# EasyEDA Pro project pcb.epro

# Schematic Schematic1
Board Name: Board1; Create Date: 2025-04-16; Page Name: P1; Project Name: slamcari; Schematic Name: Schematic1; Update Date: 2025-04-28; Company: 嘉立创EDA; Page Size: A4; Version: V1.0
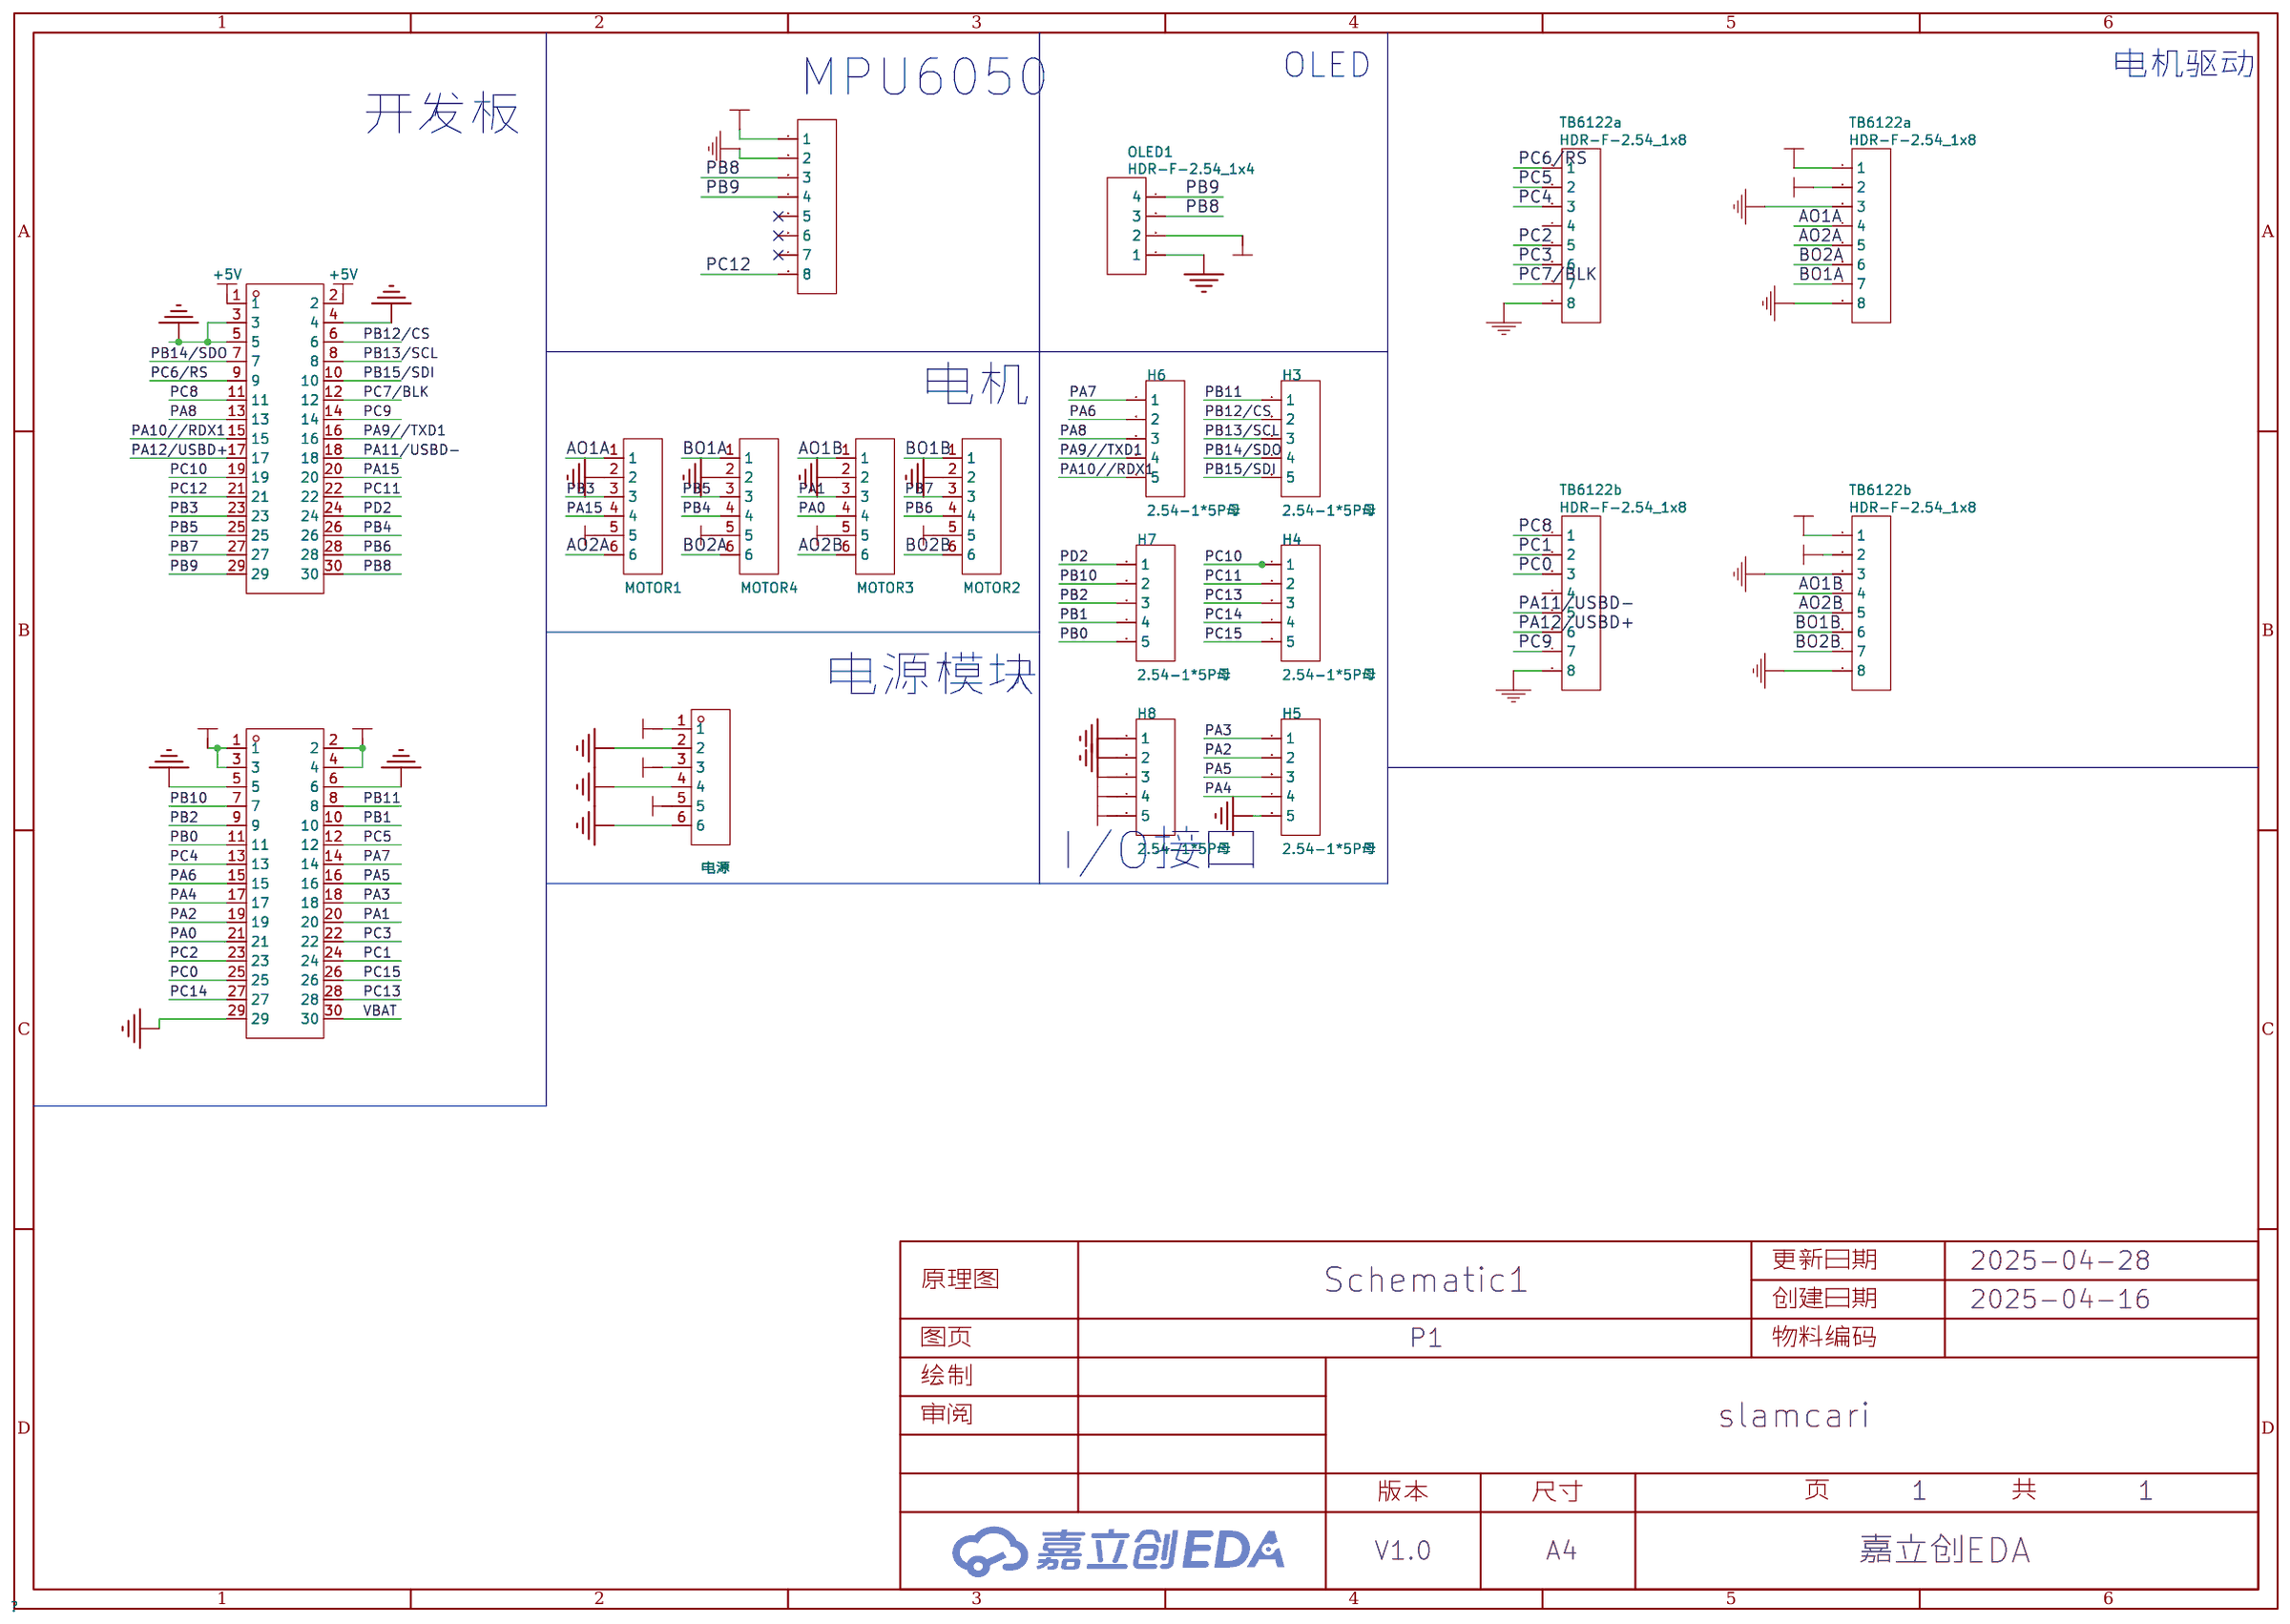
[diagram p0: schematic sheet]

## Parts
H3  2.54-1*5P母  [HDR-TH_5P-P2.54-V-F]
H4  2.54-1*5P母  [HDR-TH_5P-P2.54-V-F]
H5  2.54-1*5P母  [HDR-TH_5P-P2.54-V-F]
H6  2.54-1*5P母  [HDR-TH_5P-P2.54-V-F]
H7  2.54-1*5P母  [HDR-TH_5P-P2.54-V-F]
H8  2.54-1*5P母  [HDR-TH_5P-P2.54-V-F]
MPU6050  HDR-F-2.54_1x8  [HDR-F-2.54_1X8]
OLED1  HDR-F-2.54_1x4  [HDR-F-2.54_1X4]
P2  电源  [HDR-TH_6P-P2.54-V-F]
TB6122a  HDR-F-2.54_1x8  [HDR-F-2.54_1X8]
TB6122a#2  HDR-F-2.54_1x8  [HDR-F-2.54_1X8]
TB6122b  HDR-F-2.54_1x8  [HDR-F-2.54_1X8]
TB6122b#2  HDR-F-2.54_1x8  [HDR-F-2.54_1X8]
U1  PM254-2-15-Z-8.5  [HDR-TH_30P-P2.54-V-F-R2-C15-S2.54-2]
U2  PM254-2-15-Z-8.5  [HDR-TH_30P-P2.54-V-F-R2-C15-S2.54-2]
U7  MOTOR1  [CONN-TH_6P-P2.00_BX-PH2.0-6PWZ]
U8  MOTOR4  [CONN-TH_6P-P2.00_BX-PH2.0-6PWZ]
U9  MOTOR3  [CONN-TH_6P-P2.00_BX-PH2.0-6PWZ]
U10  MOTOR2  [CONN-TH_6P-P2.00_BX-PH2.0-6PWZ]

## Library data of the parts
H3-H8 = 2.54-1*5P母: 插孔结构:1x5P;间距:2.54mm;行距:-;安装类型:直插;排数:单排;总孔位数:5P;塑高:-;触头材质:-;触头镀层:-;; LCSC Part Name: 间距:2.54mm 1x5P 直插; Supplier Part: C50950; Manufacturer: BOOMELE(博穆精密); Supplier Footprint: 插件,P=2.54mm; JLCPCB Part Class: 扩展库; Datasheet: https://atta.szlcsc.com/upload/public/pdf/source/20210301/C2718488_F4427B881E42CAA8DDB0B1C12B3A522C.pdf; Supplier: LCSC; Holes Structure: 1x5P; Pitch: 2.54mm; Mounting Type: 直插; Number of Rows: 单排; Number of Holes: 5P
MPU6050 TB6122a TB6122a#2 TB6122b TB6122b#2 = HDR-F-2.54_1x8: Supplier Part: C225505; Supplier: LCSC
OLED1 = HDR-F-2.54_1x4: Supplier Part: C225501; Supplier: LCSC
P2 = 2.54-1*6P母: 插孔结构:1x6P;间距:2.54mm;行距:-;安装类型:直插;排数:单排;总孔位数:6P;塑高:-;触头材质:-;触头镀层:-;; LCSC Part Name: 间距:2.54mm 1x6P 直插; Supplier Part: C40877; Manufacturer: BOOMELE(博穆精密); Supplier Footprint: 插件,P=2.54mm; JLCPCB Part Class: 扩展库; Datasheet: https://atta.szlcsc.com/upload/public/pdf/source/20210301/C2718488_F4427B881E42CAA8DDB0B1C12B3A522C.pdf; Supplier: LCSC; Holes Structure: 1x6P; Pitch: 2.54mm; Mounting Type: 直插; Number of Rows: 单排; Number of Holes: 6P
U1 U2 = PM254-2-15-Z-8.5: 插孔结构:2x15P;间距:2.54mm;行距:2.54mm;圆孔/方孔:方孔;安装类型:直插;排数:双排;总孔位数:30P;额定电流:3A;额定电压:-;插孔方向:顶部;塑高:8.5mm;触头材质:铜合金;工作温度范围:-40℃~+105℃;焊接温度(最大值):260℃@5S;; LCSC Part Name: 2x15P 间距:2.54mm 直插; Supplier Part: C2897416; Manufacturer: HCTL(华灿天禄); Supplier Footprint: 插件,P=2.54mm; JLCPCB Part Class: 扩展库; Datasheet: https://atta.szlcsc.com/upload/public/pdf/source/20230609/3D36CA2C1BFC9FD1C3F709AD9DFEB9C2.pdf; Supplier: LCSC; Holes Structure: 2x15P; Pitch: 2.54mm; Row Spacing: 2.54mm; Circular Hole / Square Hole: 方孔; Mounting Type: 直插; Number of Rows: 双排; Number of Holes: 30P; Current Rating (Max): 3A; Holes Direction: 顶部; Insulation Height: 8.5mm; Contact Material: 铜合金; Operating Temperature Range: -40℃~+105℃; Soldering Temperature(Max): 260℃@5S
U7-U10 = BX-PH2.0-6PWZ: 插针结构:1x6P;间距:2mm;安装方式:弯插;参考系列:PH;总PIN数:6P;排数:1;每排PIN数:6;行距:-;额定电流:2A;触头材质:黄铜;触头镀层:锡;工作温度:-25℃~+85℃;; LCSC Part Name: 1x6P 间距:2mm 弯插 系列:PH; Supplier Part: C18077757; Manufacturer: Bossie(博锡); Supplier Footprint: 弯插,P=2mm; JLCPCB Part Class: 扩展库; Datasheet: https://atta.szlcsc.com/upload/public/pdf/source/20231017/ADE7E4C0A5BEBBBF1476E376B8A5AD42.pdf; Supplier: LCSC; Pins Structure: 1x6P; Pitch: 2mm; Mounting Type: 弯插; Reference Series: PH; Number of Pins: 6P; Number of Rows: 1; Number of PINs Per Row: 6; Current Rating: 2A; Contact Material: 黄铜; Contact Plating: 锡; Operating Temperature: -25℃~+85℃; Voltage Rating: 250V; Plastic Material: PA66; Flame Retardant Rating: UL94V-0; Color: 白色; Z-Height of the Board: 4.7mm; X-Length of Bottom Edge on Board (Spacing Line): 14mm; Y-Width of Bottom Edge on Board: 6.05mm

## Nets
+3.3V: H8.3 P2.5 U2.1 U2.2 U2.3 U2.4 U7.5 U8.5 U9.5 U10.5
+5V: H8.4 MPU6050.1 OLED1.2 P2.3 TB6122a.2 TB6122b.2 U1.1 U1.2
+12V: H8.5 P2.1 TB6122a.1 TB6122b.1
GND: H5.5 H8.1 H8.2 MPU6050.2 OLED1.1 P2.2 P2.4 P2.6 TB6122a.3 TB6122a.8 TB6122a#2.8 TB6122b.3 TB6122b.8 TB6122b#2.8 U1.3 U1.4 U1.5 U2.5 U2.6 U2.29 U7.2 U8.2 U9.2 U10.2
VBAT: U2.30
AO1A: TB6122a.4 U7.1
AO1B: TB6122b.4 U9.1
AO2A: TB6122a.5 U7.6
AO2B: TB6122b.5 U9.6
BO1A: TB6122a.7 U8.1
BO1B: TB6122b.6 U10.1
BO2A: TB6122a.6 U8.6
BO2B: TB6122b.7 U10.6
PA0: U2.21 U9.4
PA1: U2.20 U9.3
PA2: H5.2 U2.19
PA3: H5.1 U2.18
PA4: H5.4 U2.17
PA5: H5.3 U2.16
PA6: H6.2 U2.15
PA7: H6.1 U2.14
PA8: H6.3 U1.13
PA9//TXD1: H6.4 U1.16
PA10//RDX1: H6.5 U1.15
PA11/USBD-: TB6122b#2.5 U1.18
PA12/USBD+: TB6122b#2.6 U1.17
PA15: U1.20 U7.4
PB0: H7.5 U2.11
PB1: H7.4 U2.10
PB2: H7.3 U2.9
PB3: U1.23 U7.3
PB4: U1.26 U8.4
PB5: U1.25 U8.3
PB6: U1.28 U10.4
PB7: U1.27 U10.3
PB8: MPU6050.3 OLED1.3 U1.30
PB9: MPU6050.4 OLED1.4 U1.29
PB10: H7.2 U2.7
PB11: H3.1 U2.8
PB12/CS: H3.2 U1.6
PB13/SCL: H3.3 U1.8
PB14/SDO: H3.4 U1.7
PB15/SDI: H3.5 U1.10
PC0: TB6122b#2.3 U2.25
PC1: TB6122b#2.2 U2.24
PC2: TB6122a#2.5 U2.23
PC3: TB6122a#2.6 U2.22
PC4: TB6122a#2.3 U2.13
PC5: TB6122a#2.2 U2.12
PC6/RS: TB6122a#2.1 U1.9
PC7/BLK: TB6122a#2.7 U1.12
PC8: TB6122b#2.1 U1.11
PC9: TB6122b#2.7 U1.14
PC10: H4.1 U1.19
PC11: H4.2 U1.22
PC12: MPU6050.8 U1.21
PC13: H4.3 U2.28
PC14: H4.4 U2.27
PC15: H4.5 U2.26
PD2: H7.1 U1.24

Not connected (* = marked no-connect by the designer): MPU6050 5* 6* 7*; TB6122a#2 4; TB6122b#2 4

## Notes on the sheet
- OLED
- 电机驱动
- MPU6050
- 开发板
- 电机
- 电源模块
- I/O接口

# Board PCB1
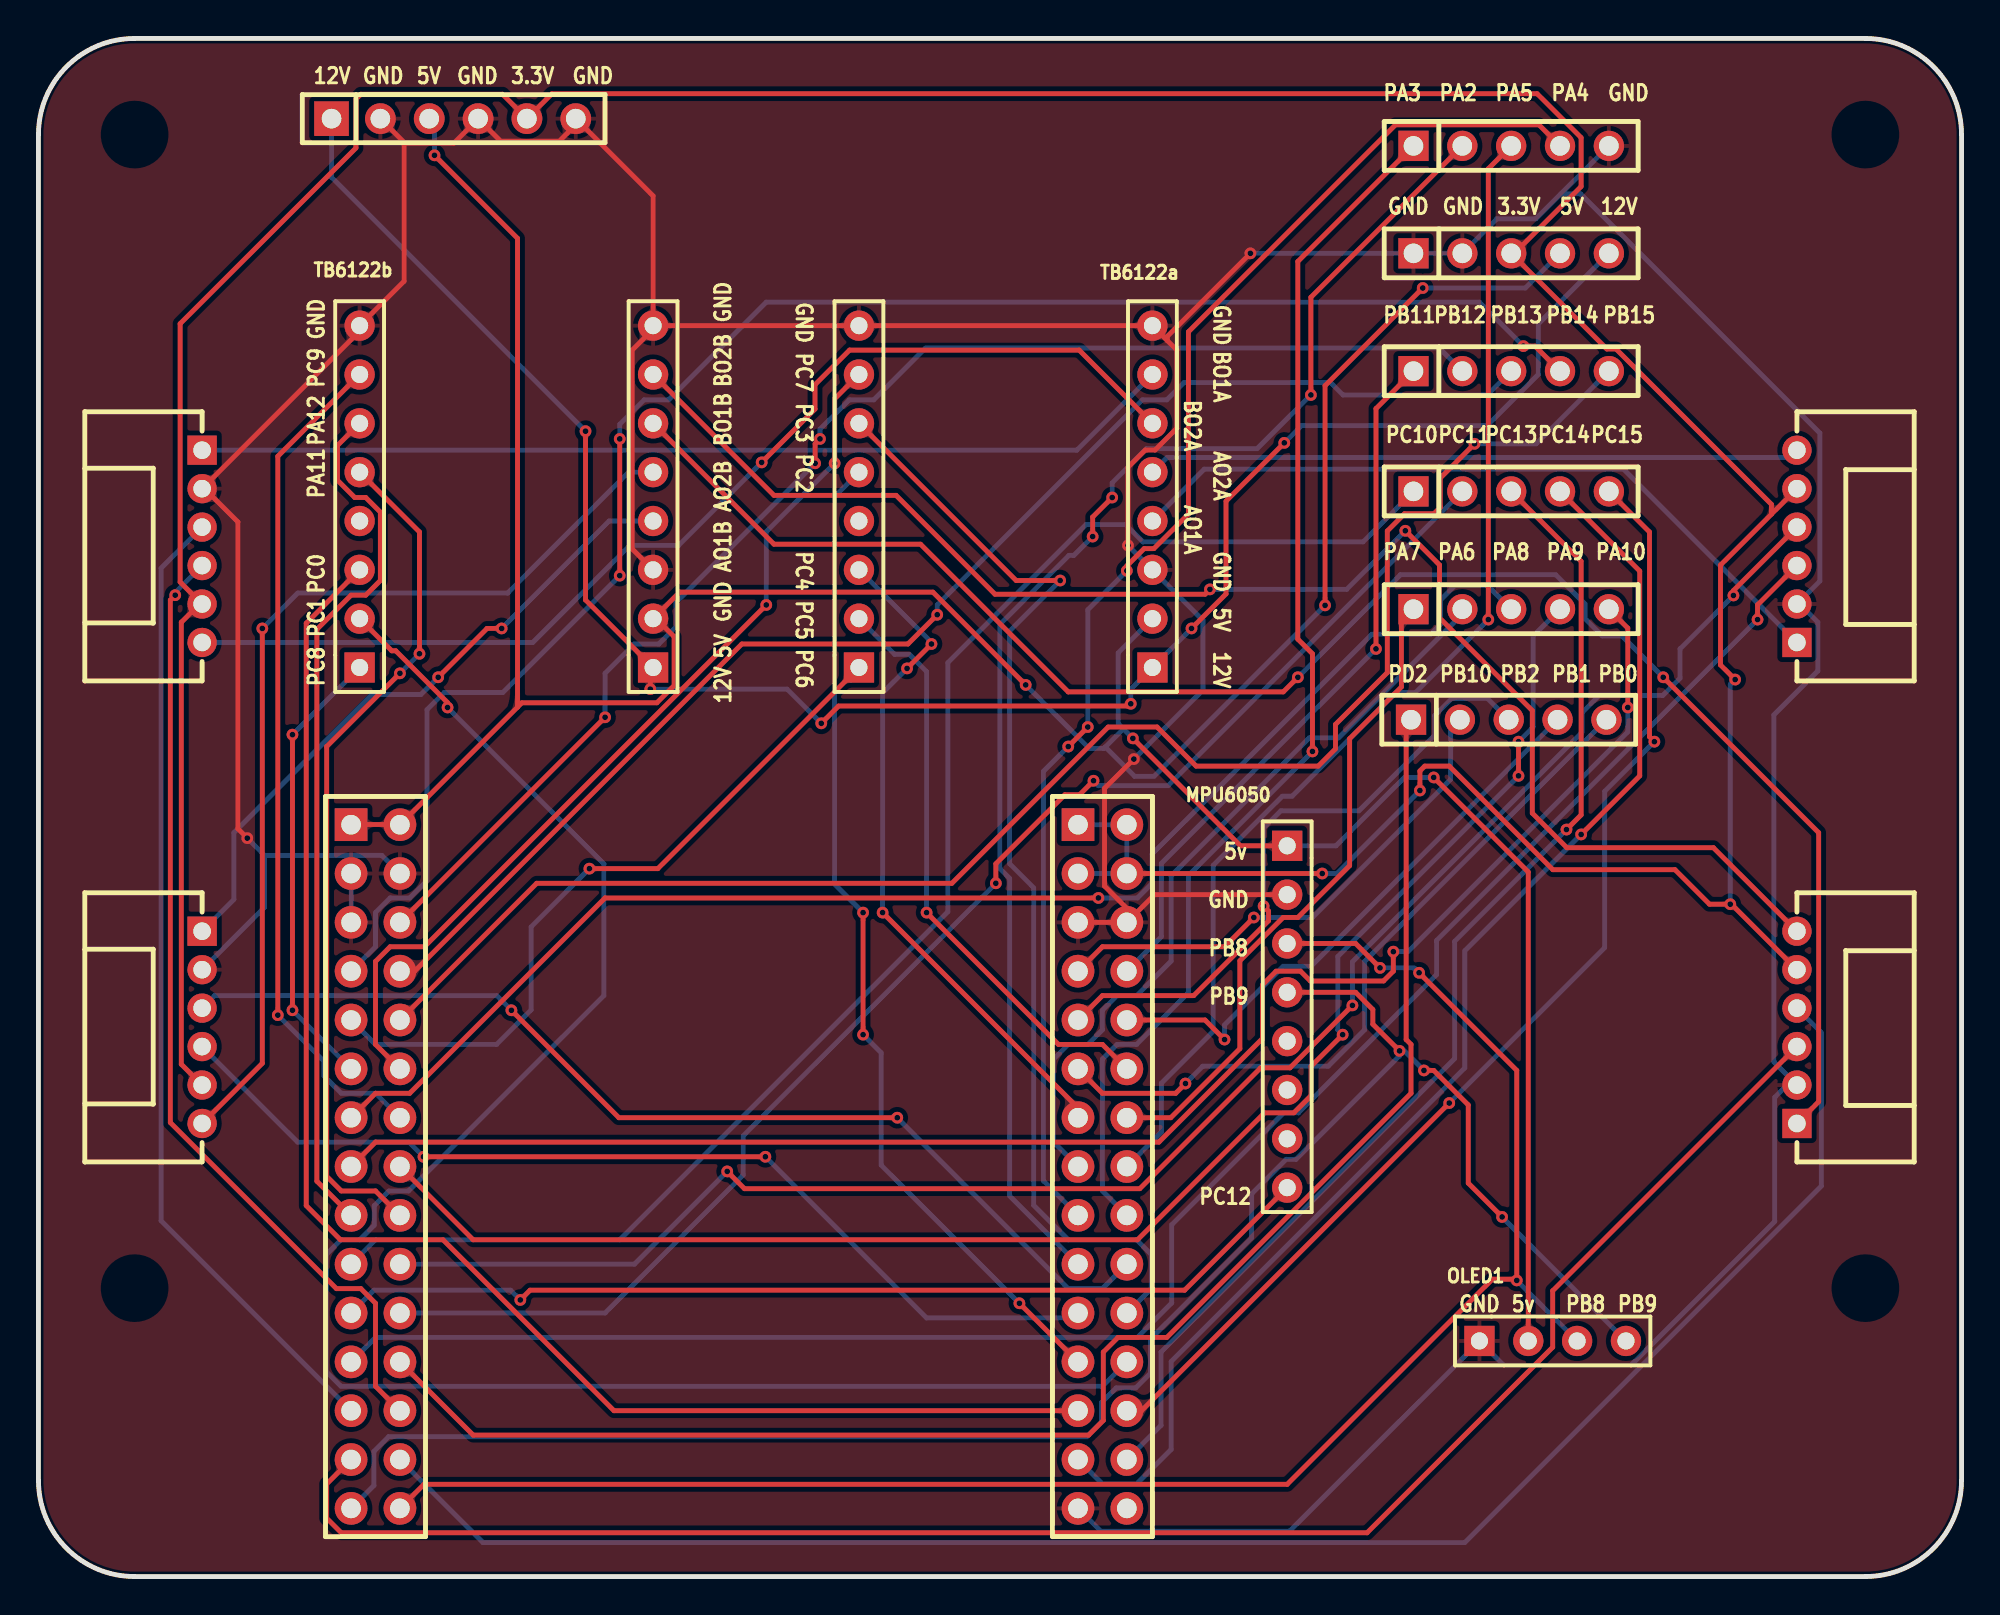
[diagram p1: board, top side]
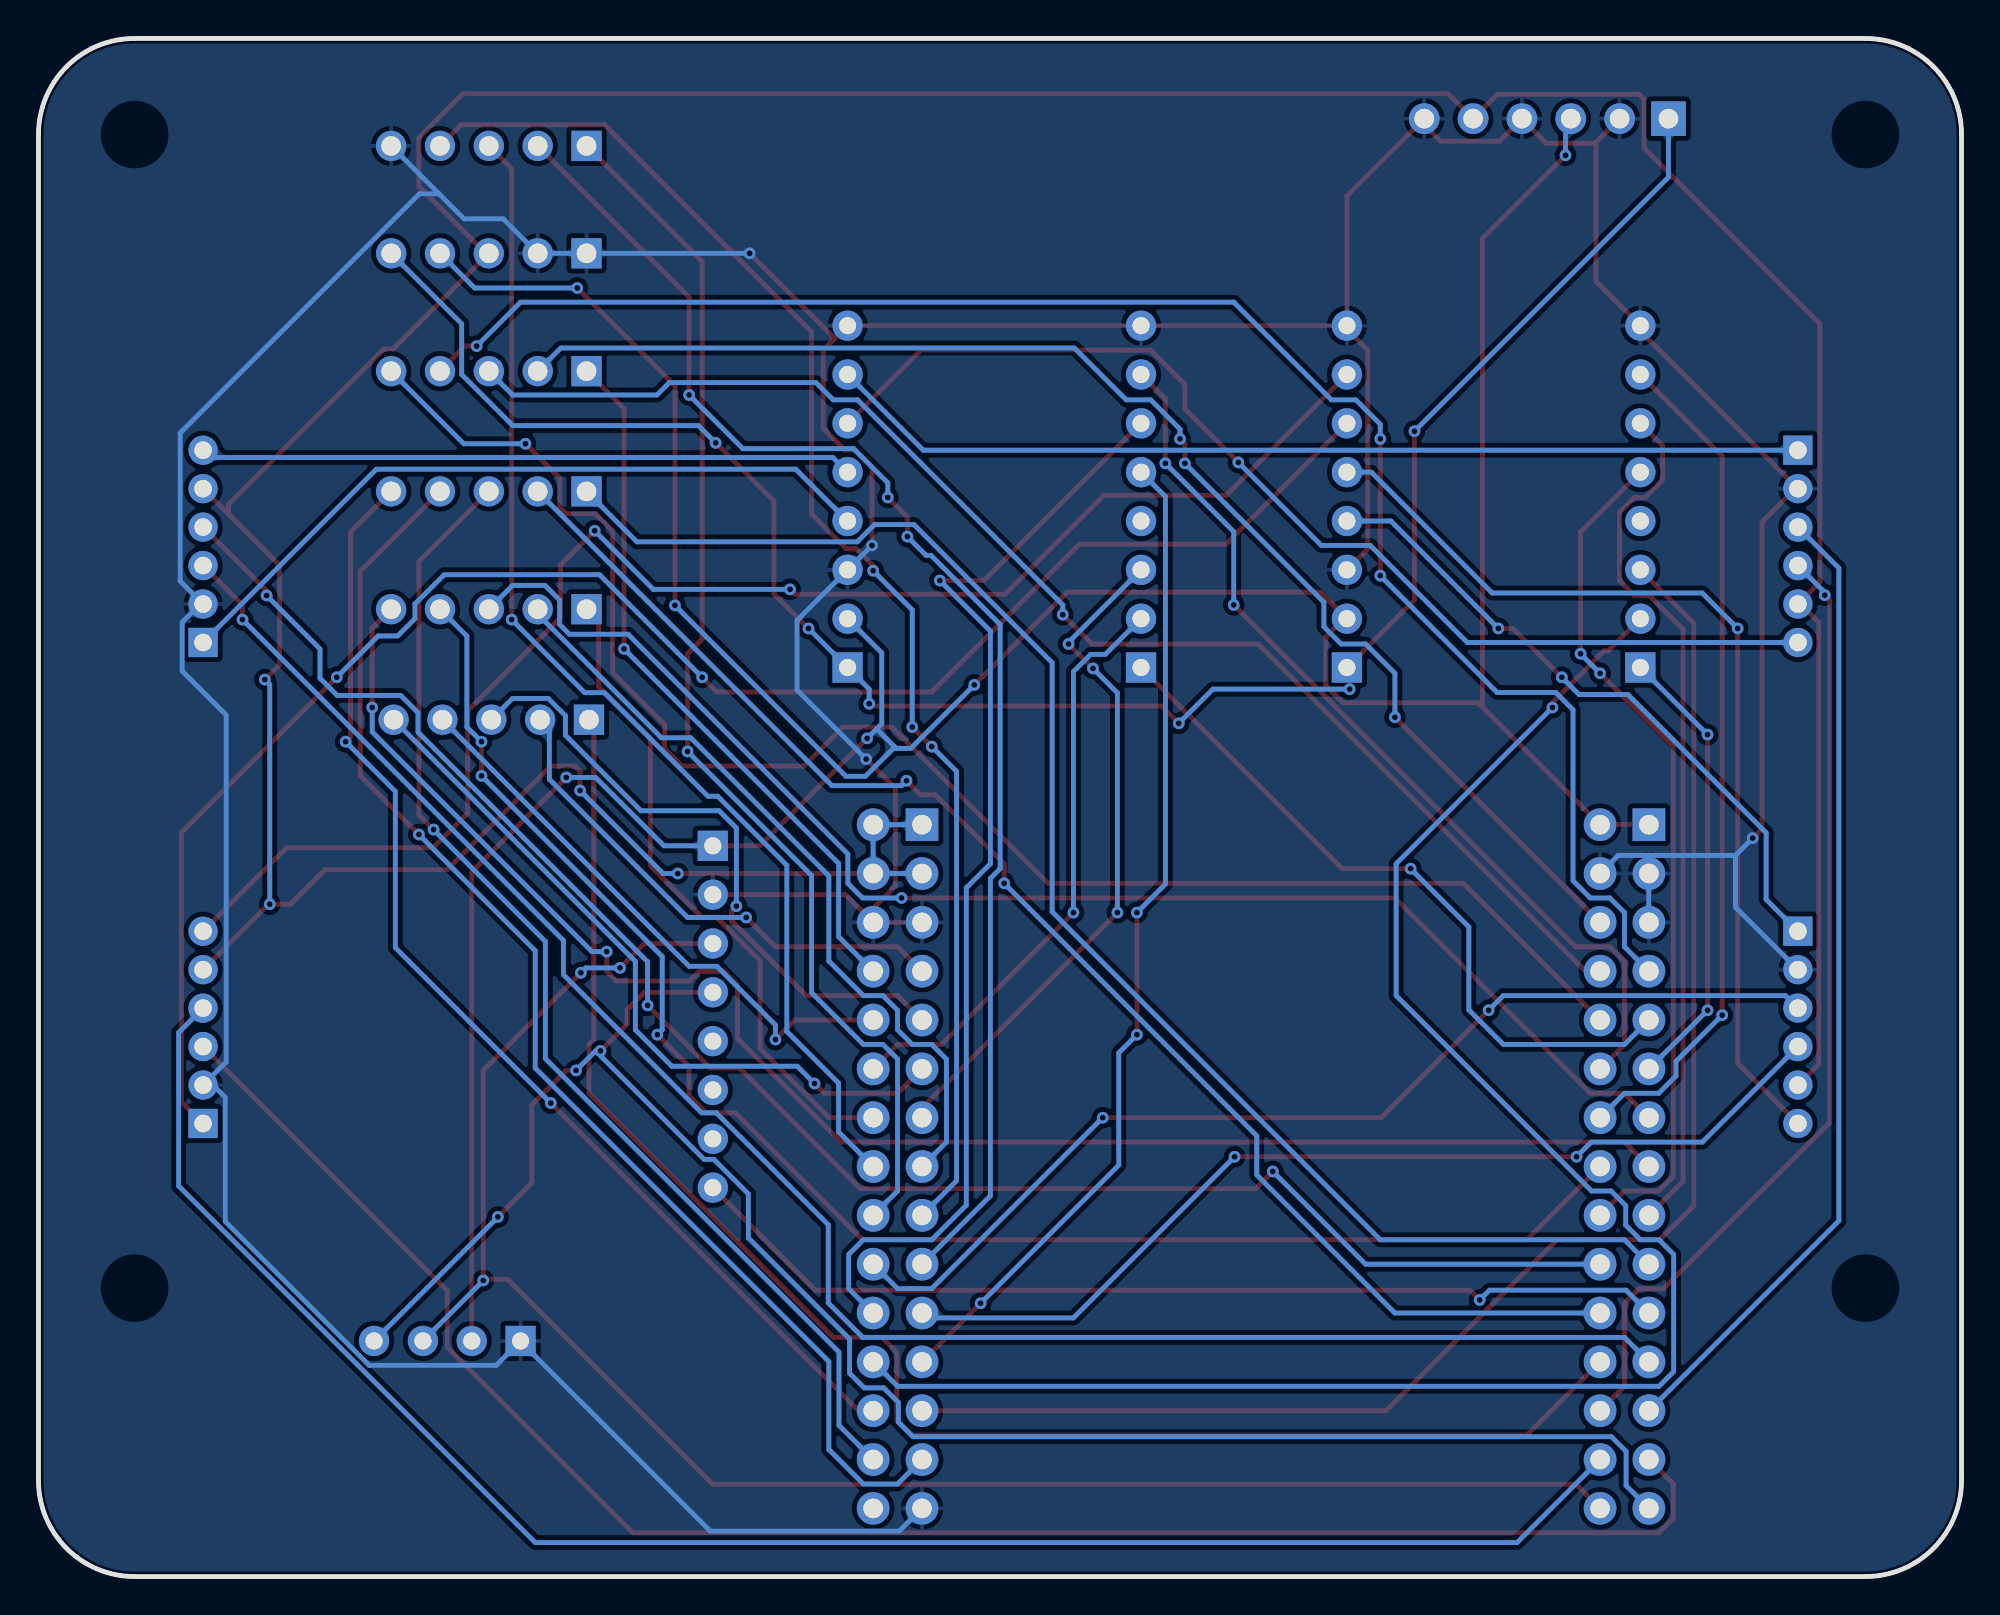
[diagram p2: board, bottom side, seen from below]

Outline 100 x 80 mm; copper layers: Top Layer, Bottom Layer. Coordinates in mm from the lower left corner of the outline.
Outline path: 0,75 0,5 arc(1.46,1.46) 5,0 95,0 arc(98.54,1.46) 100,5 100,75 arc(98.54,78.54) 95,80 5,80 arc(1.46,78.54) 0,75
Stack: Top Layer 0.035mm / Dielectric1 1.51mm FR4 er 4.5 / Bottom Layer 0.035mm

## Design rules (mm)
template: JLCPCB Capability(Two Layers Board)
spacing copperThickness1oz (default): track to track 0.102, other pairs 0.152 to 0.3
spacing copperThickness2oz: track to track 0.203, other pairs 0.152 to 0.3
track width copperThickness1oz (default): min 0.127, default 0.254, max 2.54
track width copperThickness2oz: min 0.203, default 0.254, max 2.54
differential pair differentialPair (default): width min 0.127, default 0.254, max 2.54; gap min 0.152, default 0.152
via viaSize (default): diameter min 0.5, default 0.61, max 10; hole min 0.3, default 0.305, max 6.3

## Placement (name value [footprint] x y rotation side)
H3  2.54-1*5P母  [HDR-TH_5P-P2.54-V-F]  76.58 62.7 0 top
H4  2.54-1*5P母  [HDR-TH_5P-P2.54-V-F]  76.58 56.44 0 top
H5  2.54-1*5P母  [HDR-TH_5P-P2.54-V-F]  76.58 74.41 0 top
H6  2.54-1*5P母  [HDR-TH_5P-P2.54-V-F]  76.58 50.31 0 top
H7  2.54-1*5P母  [HDR-TH_5P-P2.54-V-F]  76.45 44.57 0 top
H8  2.54-1*5P母  [HDR-TH_5P-P2.54-V-F]  76.58 68.82 0 top
MPU6050  HDR-F-2.54_1x8  [HDR-F-2.54_1X8]  64.93 30.39 270 top
OLED1  HDR-F-2.54_1x4  [HDR-F-2.54_1X4]  78.74 12.25 0 top
P2  电源  [HDR-TH_6P-P2.54-V-F]  21.59 75.83 0 top
TB6122a  HDR-F-2.54_1x8  [HDR-F-2.54_1X8]  57.93 54.9 90 top
TB6122a#2  HDR-F-2.54_1x8  [HDR-F-2.54_1X8]  42.67 54.9 90 top
TB6122b  HDR-F-2.54_1x8  [HDR-F-2.54_1X8]  31.96 54.9 90 top
TB6122b#2  HDR-F-2.54_1x8  [HDR-F-2.54_1X8]  16.7 54.9 90 top
U1  PM254-2-15-Z-8.5  [HDR-TH_30P-P2.54-V-F-R2-C15-S2.54-2]  17.53 21.33 270 top
U2  PM254-2-15-Z-8.5  [HDR-TH_30P-P2.54-V-F-R2-C15-S2.54-2]  55.33 21.33 270 top
U7  MOTOR1  [CONN-TH_6P-P2.00_BX-PH2.0-6PWZ]  91.44 53.58 90 top
U8  MOTOR4  [CONN-TH_6P-P2.00_BX-PH2.0-6PWZ]  8.51 53.58 270 top
U9  MOTOR3  [CONN-TH_6P-P2.00_BX-PH2.0-6PWZ]  8.51 28.56 270 top
U10  MOTOR2  [CONN-TH_6P-P2.00_BX-PH2.0-6PWZ]  91.44 28.56 90 top

## Footprints (pads in the part's own frame, mm; a bottom-side part is the same pattern mirrored in y, then rotated)
CONN-TH_6P-P2.00_BX-PH2.0-6PWZ
  rect 1.524x1.524 hole 0.914: 1(-5,0)
  round 1.524 hole 0.914: 2(-3,0) 3(-1,0) 4(1,0) 5(3,0) 6(5,0)
HDR-F-2.54_1X4
  rect 1.575x1.575 hole 0.889: 1(-3.81,0)
  round 1.575 hole 0.889: 2(-1.27,0) 3(1.27,0) 4(3.81,0)
HDR-F-2.54_1X8
  rect 1.575x1.575 hole 0.889: 1(-7.62,0)
  round 1.575 hole 0.889: 2(-5.08,0) 3(-2.54,0) 4(0,0) 5(2.54,0) 6(5.08,0) 7(7.62,0) 8(10.16,0)
HDR-TH_5P-P2.54-V-F
  rect 1.575x1.575 hole 1.02: 1(-5.08,0)
  round 1.575 hole 1.02: 2(-2.54,0) 3(0,0) 4(2.54,0) 5(5.08,0)
HDR-TH_6P-P2.54-V-F
  rect 1.8x1.8 hole 1.02: 1(-6.35,0)
  round 1.6 hole 1.02: 2(-3.81,0) 3(-1.27,0) 4(1.27,0) 5(3.81,0) 6(6.35,0)
HDR-TH_30P-P2.54-V-F-R2-C15-S2.54-2
  rect 1.7x1.7 hole 1.02: 1(-17.78,-1.27)
  round 1.7 hole 1.02: 2(-17.78,1.27) 3(-15.24,-1.27) 4(-15.24,1.27) 5(-12.7,-1.27) 6(-12.7,1.27) 7(-10.16,-1.27) 8(-10.16,1.27) 9(-7.62,-1.27) 10(-7.62,1.27) 11(-5.08,-1.27) 12(-5.08,1.27) 13(-2.54,-1.27) 14(-2.54,1.27) 15(0,-1.27) 16(0,1.27) 17(2.54,-1.27) 18(2.54,1.27) 19(5.08,-1.27) 20(5.08,1.27) 21(7.62,-1.27) 22(7.62,1.27) 23(10.16,-1.27) 24(10.16,1.27) 25(12.7,-1.27) 26(12.7,1.27) 27(15.24,-1.27) 28(15.24,1.27) 29(17.78,-1.27) 30(17.78,1.27)

## Nets
As in the schematic.

Pads without a net: MPU6050 5 6 7; TB6122a#2 4; TB6122b#2 4

## Via types
v1: diameter 0.61, hole 0.305, Top Layer to Bottom Layer, 94 vias

## Routing (per net, layer and track width the routed paths; a pad name or vN(x,y) marks a point on that pad's centre or on a via; arc(x,y) is an arc through that point)
+3.3V: length 222.8
  Top Layer w0.254: v1(71.84,40.88) 71.84,41.9 72.09,42.15 73.36,42.15 78.75,36.77 85.1,36.77 86.89,34.97 88.03,34.97 U10.5 ; 90.12,55.26 U7.5 ; 90.12,55.26 90.12,55.77 82.03,63.85 81.56,63.85 76.66,68.74 ; 90.12,55.26 87.47,52.61 87.47,47.42 v1(88.23,46.65) ; 76.66,68.74 H8.3 ; 76.66,68.74 80.22,72.3 80.22,74.84 77.93,77.13 26.7,77.13 P2.5 24.13,77.1 16.76,77.1 16.51,76.84 16.51,74.31 7.37,65.16 7.37,51.73 8.44,50.65 ; 8.44,50.65 U8.5 ; 8.44,50.65 7.43,49.63 7.43,26.65 U9.5 ; U2.4 v1(66.76,36.57)
  Bottom Layer w0.254: v1(88.23,46.65) 87.97,46.4 v1(87.97,34.97) ; v1(66.76,36.57) 67.52,36.57 v1(71.84,40.88) ; U2.3 U2.4 U2.2 U2.1
+5V: length 185.4
  Top Layer w0.254: 32.04,49.9 33.06,48.88 33.06,46.34 32.16,45.45 25.14,45.45 24.91,45.22 ; 32.04,49.9 33.34,51.2 46.51,51.2 v1(51.34,46.38) ; 32.04,49.9 TB6122b.2 ; 18.8,39.11 16.26,39.11 U1.1 ; 18.8,39.11 24.91,45.22 ; 18.8,39.11 U1.2 ; v1(72.55,41.56) 77.47,36.65 OLED1.2 ; 24.91,45.22 24.91,69.61 v1(20.59,73.92) ; v1(71.98,67.02) 66.9,61.94 v1(66.9,50.51) ; v1(56.91,43.6) 62.5,38.01 MPU6050.1
  Bottom Layer w0.254: v1(51.34,46.38) 54.64,43.07 55.4,43.07 55.47,43.15 ; P2.3 20.59,75.56 v1(20.59,73.92) ; 56.42,44.09 55.47,43.15 ; 56.42,44.09 v1(56.91,43.6) ; 56.42,44.09 56.15,44.36 56.15,48.04 TB6122a.2 ; 55.47,43.15 57,41.62 58.01,41.62 v1(66.9,50.51) ; v1(71.98,67.02) 77.32,67.02 H8.4 ; MPU6050.1 67.47,38.01 71.03,41.56 v1(72.55,41.56)
+12V: length 102.3
  Top Layer w0.254: v1(40.71,44.38) 41.6,45.28 56.68,45.28 v1(56.8,45.39) ; v1(59.96,49.31) 61.75,51.11 61.75,55.94 v1(64.78,58.97) ; 31.82,47.43 28.45,50.79 v1(28.45,59.57) ; 31.82,47.43 TB6122b.1 ; 31.82,47.43 v1(31.82,46.16)
  Bottom Layer w0.254: v1(56.8,45.39) 56.8,46.16 TB6122a.1 v1(59.96,49.31) ; v1(31.82,46.16) 38.93,46.16 v1(40.71,44.38) ; P2.1 15.24,72.78 v1(28.45,59.57) ; v1(64.78,58.97) 65.68,59.86 75.33,59.86 77.99,62.52 77.99,65.16 H8.5
GND: length 308.2
  Top Layer w0.254: 56.96,34.39 55.44,35.91 55.44,40.99 v1(56.96,42.52) ; 56.96,34.39 U2.6 U2.5 ; 56.96,34.39 58.04,35.47 MPU6050.2 ; 32.15,65.06 TB6122b.8 31.96,71.81 28.1,75.67 ; 32.15,65.06 TB6122a#2.8 TB6122a.8 58.7,64.29 ; 32.15,65.06 30.88,63.79 30.88,53.45 TB6122b.3 ; v1(10.86,38.41) 10.37,38.9 10.37,54.85 8.57,56.65 ; 28.1,75.67 P2.6 ; 28.1,75.67 27.08,74.65 24.03,74.65 22.87,75.82 ; 19.01,74.6 19.06,74.55 21.6,74.55 22.87,75.82 ; 19.01,74.6 19.01,67.37 TB6122b#2.8 16.7,64.78 8.57,56.65 ; 19.01,74.6 P2.2 ; 22.87,75.82 P2.4 ; 8.57,56.65 U8.2 ; 58.7,64.29 59.2,63.79 59.2,59.73 58.06,58.59 57.55,58.59 56.66,57.7 v1(56.66,53.63) ; 58.7,64.29 58.7,64.51 v1(63.02,68.82)
  Bottom Layer w0.254: 74.94,12.24 76.2,10.98 82.8,10.98 90.29,18.47 90.29,24.92 91.18,25.82 ; 74.94,12.24 OLED1.1 ; 74.94,12.24 65.06,2.36 55.24,2.36 U2.29 ; U1.4 17.85,37.51 16.27,37.51 ; v1(63.02,68.82) H8.1 H8.2 75.84,70.62 77.87,70.62 79.17,71.92 ; U1.5 16.27,34.04 16.27,36.58 ; 11.76,37.51 11.76,34.81 U9.2 ; 11.76,37.51 16.27,37.51 ; 11.76,37.51 v1(10.86,38.41) ; 79.17,71.92 H5.5 ; 79.17,71.92 80.19,71.92 92.63,59.48 92.63,51.78 91.51,50.65 ; 16.27,37.51 16.27,36.58 ; 91.18,25.82 U10.2 ; 91.18,25.82 90.24,26.76 90.24,44.81 92.53,47.1 92.53,49.64 91.51,50.65 ; v1(56.66,53.63) TB6122a.3 60.55,49.73 60.55,46.11 v1(56.96,42.52) ; 16.27,36.58 U1.3 ; 91.51,50.65 U7.2
AO1A: length 38.4
  Bottom Layer w0.254: TB6122a.4 60.62,57.6 82.43,57.6 U7.1
AO1B: length 34.3
  Top Layer w0.254: v1(20.78,46.77) 23.32,49.31 v1(24.09,49.31)
  Bottom Layer w0.254: v1(24.09,49.31) 29.67,54.9 TB6122b.4 ; v1(20.78,46.77) 19.89,45.88 17.35,45.88 10.16,38.69 10.16,35.22 U9.1
AO2A: length 34
  Bottom Layer w0.254: TB6122a.5 58.69,58.2 91.06,58.2 U7.6
AO2B: length 50.7
  Top Layer w0.254: U9.6 11.64,26.7 v1(11.64,49.31)
  Bottom Layer w0.254: v1(11.64,49.31) 13.48,51.16 24.4,51.16 30.69,57.44 TB6122b.5
BO1A: length 51
  Bottom Layer w0.254: U8.1 53.99,58.58 TB6122a.7
BO1B: length 90.5
  Top Layer w0.254: v1(65.49,46.77) 64.73,46.01 53.55,46.01 45.87,53.69 38.25,53.69 TB6122b.6 ; v1(84.49,46.77) 92.57,38.69 92.57,24.69 U10.1
  Bottom Layer w0.254: v1(65.49,46.77) 70.82,52.11 78.9,52.11 80.42,50.58 80.42,49.82 81.32,48.92 82.34,48.92 v1(84.49,46.77)
BO2A: length 58
  Top Layer w0.254: TB6122a.6 54.12,63.79 42.18,63.79 40.38,62 40.38,60.73 v1(37.61,57.95)
  Bottom Layer w0.254: U8.6 25.7,48.58 30.75,53.63 33.29,53.63 v1(37.61,57.95)
BO2B: length 78.9
  Top Layer w0.254: TB6122b.7 38.25,56.23 44.6,56.23 49.74,51.09 60.66,51.09 v1(60.92,51.35) ; v1(71.08,54.39) 72.85,52.62 72.85,49.86 77.68,45.04 77.68,39.7 79.48,37.91 87.1,37.91 U10.6
  Bottom Layer w0.254: v1(60.92,51.35) 68.03,51.35 v1(71.08,54.39)
PA0: length 51.5
  Top Layer w0.254: v1(37.8,21.83) v1(20.02,21.83)
  Bottom Layer w0.254: U9.4 13.48,22.6 19.26,22.6 v1(20.02,21.83) ; v1(37.8,21.83) 46.18,13.45 53.8,13.45 U2.21
PA1: length 55.2
  Top Layer w0.254: v1(44.66,23.87) 30.18,23.87 v1(24.59,29.45)
  Bottom Layer w0.254: v1(44.66,23.87) 53.55,14.98 55.33,14.98 U2.20 ; v1(24.59,29.45) 23.83,30.22 9.16,30.22 U9.3
PA2: length 73.3
  Top Layer w0.254: v1(66.17,61.46) 66.17,66.54 H5.2 ; v1(55.83,56.12) 54.82,55.11 v1(54.82,54.09)
  Bottom Layer w0.254: v1(55.83,56.12) 55.83,56.89 57.61,58.66 63.37,58.66 v1(66.17,61.46) ; v1(54.82,54.09) 53.84,53.11 53.58,53.11 49.99,49.52 49.99,36.82 50.5,36.31 50.5,19.8 U2.19
PA3: length 64.1
  Top Layer w0.254: v1(66.25,42.92) 66.25,48 65.49,48.76 65.49,68.4 H5.1
  Bottom Layer w0.254: U2.18 55.33,20.06 55.33,26.91 56.09,27.68 57.1,27.68 59.8,30.37 59.8,36.47 v1(66.25,42.92)
PA4: length 74.4
  Top Layer w0.254: H5.4 78.02,75.51 70.57,75.51 59.8,64.74 59.8,55.26 58,53.47 57.49,53.47 56.6,52.57 v1(56.6,52.31) ; v1(53.55,43.17) v1(54.56,44.19)
  Bottom Layer w0.254: U2.17 52.26,20.58 52.26,41.88 v1(53.55,43.17) ; v1(56.6,52.31) 54.56,50.28 v1(54.56,44.19)
PA5: length 62.3
  Top Layer w0.254: v1(75.39,49.77) 75.39,73.22 H5.3
  Bottom Layer w0.254: U2.16 58.39,23.12 58.39,25.66 61.09,28.36 61.09,36.99 64.68,40.58 65.19,40.58 70.57,45.97 71.59,45.97 v1(75.39,49.77)
PA6: length 40.4
  Bottom Layer w0.254: U2.15 52.79,22.6 52.79,26.91 53.55,27.68 54.56,27.68 55.33,28.44 55.33,29.45 56.09,30.22 57.1,30.22 58.9,32.01 58.9,36.44 66.08,43.63 67.61,43.63 73.89,49.91 73.89,50.17 H6.2
PA7: length 34.4
  Top Layer w0.254: U2.14 58.88,23.87 62.47,27.46 62.47,32.03 64.72,34.28 65.49,34.28 68.18,36.97 68.18,43.58 70.87,46.27 70.87,49.69 H6.1
PA8: length 73.9
  Top Layer w0.254: U1.13 17.53,25.14 19.3,25.14 29.46,35.3 v1(55.12,35.3)
  Bottom Layer w0.254: H6.3 75.34,51.55 73.66,51.55 72.9,50.79 72.9,49.52 72.39,49.01 69.34,49.01 57.91,37.58 57.91,36.06 57.15,35.3 v1(55.12,35.3)
PA9//TXD1: length 82.9
  Top Layer w0.254: v1(76.96,41.65) v1(76.96,43.42) ; U1.16 22.61,17.52 57.15,17.52 63.75,24.12 65.28,24.12 66.18,25.02 66.18,26.54 v1(67.82,28.18)
  Bottom Layer w0.254: v1(67.82,28.18) 67.56,28.44 67.56,32.25 v1(76.96,41.65) ; H6.4 77.72,48.92 77.72,44.19 v1(76.96,43.42)
PA10//RDX1: length 85.2
  Top Layer w0.254: v1(82.65,45.2) 82.65,49.33 H6.5 ; v1(70.45,32.5) 70.45,31.49 69.94,30.98 66.13,30.98 65.63,31.49 64.36,31.49 63.65,30.78 63.65,27.98 58.26,22.6 17.53,22.6 U1.15
  Bottom Layer w0.254: v1(70.45,32.5) 71.22,32.5 82.65,43.93 v1(82.65,45.2)
PA11/USBD-: length 44.6
  Top Layer w0.254: v1(18.8,46.98) 14.99,43.17 14.99,20.82 15.75,20.06 17.53,20.06 U1.18 ; TB6122b#2.5 19.81,54.33 v1(19.81,48)
  Bottom Layer w0.254: v1(18.8,46.98) v1(19.81,48)
PA12/USBD+: length 45.5
  Top Layer w0.254: U1.17 14.48,20.56 14.48,49.27 16.26,51.04 17.02,51.04 17.78,51.81 17.78,55.36 17.02,56.12 16.45,56.12 15.55,57.02 15.55,58.83 TB6122b#2.6
PA15: length 92.2
  Top Layer w0.254: v1(35.81,21.07) 36.71,20.17 57.27,20.17 63.55,26.46 65.08,26.46 v1(68.33,29.71) ; U7.4 88.14,51.28 v1(88.14,51.03)
  Bottom Layer w0.254: U1.20 30.99,16.25 v1(35.81,21.07) ; v1(88.14,51.03) 85.36,48.25 85.36,46.73 84.46,45.83 81.16,45.83 80.26,44.93 80.26,43.92 68.33,31.98 v1(68.33,29.71)
PB0: length 38.1
  Top Layer w0.254: U2.11 55.33,25.14 59.14,25.14 v1(59.64,25.64)
  Bottom Layer w0.254: H7.5 68.96,31.99 68.96,28.44 67.06,26.54 60.54,26.54 v1(59.64,25.64)
PB1: length 30.2
  Top Layer w0.254: U2.10 60.66,28.95 v1(61.68,27.93)
  Bottom Layer w0.254: v1(61.68,27.93) 61.68,28.69 64.72,31.74 66.17,31.74 H7.4
PB2: length 33.6
  Top Layer w0.254: U2.9 55.33,30.22 60.07,30.22 63.96,34.11 63.96,34.61 v1(63.71,34.87)
  Bottom Layer w0.254: H7.3 75.35,45.67 73.5,45.67 72.6,44.78 72.6,43.76 68.67,39.83 64.61,39.83 63.71,38.93 v1(63.71,34.87)
PB3: length 96.2
  Top Layer w0.254: U7.3 89.39,50.54 v1(89.39,49.77)
  Bottom Layer w0.254: U1.23 17.53,12.44 57.13,12.44 58.93,14.23 58.93,18.3 64.75,24.12 65.52,24.12 72.7,31.3 72.7,33.08 v1(89.39,49.77)
PB4: length 50.3
  Top Layer w0.254: v1(7.11,51.04) 6.86,50.79 6.86,23.61 15.49,14.98 16.76,14.98 17.53,14.21 17.53,9.9 U1.26
  Bottom Layer w0.254: v1(7.11,51.04) 7.11,51.19 U8.4
PB5: length 50.9
  Bottom Layer w0.254: U1.25 6.38,18.5 6.38,52.45 U8.3
PB6: length 93.2
  Bottom Layer w0.254: U10.4 92.71,28.3 92.71,20.31 74.17,1.77 23.11,1.77 U1.28
PB7: length 92.5
  Top Layer w0.254: U1.27 14.99,4.82 14.99,3.04 15.75,2.28 69.09,2.28 78.74,11.93 78.74,14.87 U10.3
PB8: length 93.1
  Top Layer w0.254: 76.87,15.47 76.87,26.32 v1(71.79,31.4) ; 76.87,15.47 v1(76.87,15.4) ; 76.87,15.47 75.6,15.47 64.93,4.8 20.05,4.8 U1.30 ; v1(69.76,31.66) 68.49,32.93 MPU6050.3
  Bottom Layer w0.254: OLED1.3 76.87,15.39 v1(76.87,15.4) ; v1(69.76,31.66) 71.54,31.66 v1(71.79,31.4)
PB9: length 96.5
  Top Layer w0.254: v1(72.05,26.32) 72.55,26.32 74.35,24.53 74.35,20.46 v1(76.11,18.7) ; v1(70.78,27.34) 69.39,28.73 69.39,29.49 68.49,30.39 MPU6050.4
  Bottom Layer w0.254: OLED1.4 76.11,18.69 v1(76.11,18.7) ; v1(72.05,26.32) 71.03,27.34 v1(70.78,27.34) 70.78,27.09 65.39,21.7 64.88,21.7 63.08,19.9 63.08,17.62 57.82,12.35 57.82,10.58 57.06,9.81 56.04,9.81 55.28,9.05 55.28,8.04 54.52,7.27 18.21,7.27 17.44,6.51 17.44,4.73 U1.29
PB10: length 26.8
  Top Layer w0.254: v1(63.2,34.28) 61.68,32.76 55.33,32.76 U2.7
  Bottom Layer w0.254: v1(63.2,34.28) 66.25,34.28 73.43,41.46 73.43,44.08 H7.2
PB11: length 37.4
  Top Layer w0.254: v1(69.55,48.25) 69.55,60.75 H3.1
  Bottom Layer w0.254: U2.8 58.39,33.28 58.39,37.09 v1(69.55,48.25)
PB12/CS: length 71.1
  Top Layer w0.254: v1(40.64,59.17) 40.39,58.92 v1(40.39,57.9) ; U1.6 v1(29.46,44.69)
  Bottom Layer w0.254: v1(29.46,44.69) 29.46,46.98 30.99,48.5 32.26,48.5 33.16,49.4 33.16,50.67 v1(40.39,57.9) ; v1(40.64,59.17) 40.64,59.68 42.16,61.2 43.43,61.2 46.13,63.9 72.84,63.9 H3.2
PB13/SCL: length 71.5
  Top Layer w0.254: U1.8 19.56,31.49 36.58,48.5 45.21,48.5 v1(46.74,50.03)
  Bottom Layer w0.254: v1(46.74,50.03) 46.74,50.54 57.4,61.2 58.67,61.2 59.57,62.1 67.19,62.1 67.84,61.46 75.34,61.46 H3.3
PB14/SDO: length 89.6
  Top Layer w0.254: v1(77.22,64) 77.82,64 H3.4 ; v1(30.23,52.06) v1(30.23,59.17)
  Bottom Layer w0.254: v1(77.22,64) 74.93,66.28 37.85,66.28 32.77,61.2 31.5,61.2 30.23,59.93 v1(30.23,59.17) ; v1(30.23,52.06) 24.15,45.98 21.1,45.98 20.2,45.08 20.2,36.19 19.3,35.3 18.29,35.3 17.53,34.53 17.53,32.76 U1.7
PB15/SDI: length 84.5
  Top Layer w0.254: v1(74.68,58.92) 72.9,57.14 72.9,55.62 72.56,55.28 71.04,55.28 70.14,54.38 70.14,47.02 67.45,44.32 67.45,43.05 66.55,42.15 60.2,42.15 58.17,44.19 55.63,44.19 47.5,36.06 25.91,36.06 U1.10
  Bottom Layer w0.254: H3.5 77.88,58.92 v1(74.68,58.92)
PC0: length 78.8
  Top Layer w0.254: U2.25 29.93,8.63 21.04,17.52 15.7,17.52 13.92,19.29 13.92,49.58 TB6122b#2.3
PC1: length 94.2
  Top Layer w0.254: v1(21.27,45.2) 21.27,45.46 18.58,48.15 18.37,48.15 TB6122b#2.2
  Bottom Layer w0.254: U2.24 55.33,9.9 15.73,9.9 14.97,10.66 14.97,16.75 15.73,17.52 16.7,17.52 17.46,18.28 17.46,19.29 18.22,20.06 19.24,20.06 29.4,30.22 29.4,37.07 v1(21.27,45.2)
PC2: length 52
  Top Layer w0.254: U2.23 v1(51.01,14.21) ; v1(42.88,28.18) v1(42.88,34.53)
  Bottom Layer w0.254: v1(51.01,14.21) 43.82,21.4 43.82,27.24 v1(42.88,28.18) ; TB6122a#2.5 41.4,56.17 41.4,36.02 v1(42.88,34.53)
PC3: length 58.7
  Top Layer w0.254: v1(53.13,51.81) 50.84,51.81 TB6122a#2.6
  Bottom Layer w0.254: v1(53.13,51.81) 50.5,49.18 50.5,37.07 51.75,35.82 51.75,19.31 53.55,17.52 57.1,17.52 57.87,16.75 57.87,14.98 U2.22
PC4: length 35.3
  Top Layer w0.254: v1(45.17,47.23) v1(46.44,48.5) ; U2.13 54.06,24.37 v1(43.9,34.53)
  Bottom Layer w0.254: v1(45.17,47.23) 43.9,45.96 v1(43.9,34.53) ; TB6122a#2.3 46.44,48.59 v1(46.44,48.5)
PC5: length 31
  Top Layer w0.254: v1(46.18,34.53) 53.04,27.68 55.33,27.68 U2.12
  Bottom Layer w0.254: TB6122a#2.2 44.52,47.97 45.28,47.97 46.18,47.07 v1(46.18,34.53)
PC6/RS: length 37.6
  Top Layer w0.254: TB6122a#2.1 32.2,36.82 v1(28.65,36.82)
  Bottom Layer w0.254: U1.9 17.53,27.68 23.82,27.68 25.62,29.47 25.62,33.79 v1(28.65,36.82)
PC7/BLK: length 48.1
  Top Layer w0.254: TB6122a#2.7 41.4,61.26 v1(41.4,57.9) ; U1.12 17.53,27.68 17.53,31.99 18.29,32.76 20.07,32.76 v1(37.85,50.54)
  Bottom Layer w0.254: v1(37.85,50.54) 37.85,54.35 v1(41.4,57.9)
PC8: length 23.6
  Top Layer w0.254: v1(13.21,29.45) v1(13.21,43.79)
  Bottom Layer w0.254: v1(13.21,43.79) TB6122b#2.1 ; U1.11 v1(13.21,29.45)
PC9: length 44.1
  Top Layer w0.254: v1(12.45,29.2) 12.45,58.27 TB6122b#2.7
  Bottom Layer w0.254: v1(12.45,29.2) 14.85,26.8 14.85,26.03 15.75,25.14 17.53,25.14 U1.14
PC10: length 80.2
  Bottom Layer w0.254: H4.1 68.88,53.82 57.42,53.82 56.53,54.72 54.47,54.72 47.29,47.53 47.29,34.58 30.23,17.52 17.53,17.52 U1.19
PC11: length 74.9
  Top Layer w0.254: v1(49.78,36.06) 49.78,37.07 53.38,40.67 54.14,40.67 v1(54.86,41.39)
  Bottom Layer w0.254: H4.2 58.74,41.14 55.12,41.14 v1(54.86,41.39) ; U1.22 29.46,13.71 36.65,20.89 36.65,22.92 v1(49.78,36.06)
PC12: length 51.8
  Top Layer w0.254: MPU6050.8 59.6,14.89 25.56,14.89 v1(25.06,14.39)
  Bottom Layer w0.254: v1(25.06,14.39) 24.55,14.89 17.44,14.89 U1.21
PC13: length 61.6
  Top Layer w0.254: H4.3 80.22,52.8 80.22,39.61 v1(79.46,38.85)
  Bottom Layer w0.254: U2.28 58.37,7.86 58.37,11.67 73.64,26.94 73.64,33.04 v1(79.46,38.85)
PC14: length 67.8
  Top Layer w0.254: v1(80.22,38.6) 83.27,41.65 83.27,52.3 H4.4
  Bottom Layer w0.254: U2.27 55.33,4.82 57.1,4.82 58.9,6.61 58.9,11.18 74.17,26.45 74.17,32.55 v1(80.22,38.6)
PC15: length 60.6
  Top Layer w0.254: v1(73.36,24.63) 57.36,8.63 U2.26 ; H4.5 83.77,54.33 83.77,43.68 v1(84.03,43.42)
  Bottom Layer w0.254: v1(73.36,24.63) 81.44,32.71 81.44,40.84 v1(84.03,43.42)
PD2: length 83.2
  Top Layer w0.254: U1.24 22.61,7.36 54.61,7.36 55.37,8.12 55.37,11.67 56.13,12.44 58.67,12.44 71.37,25.14 71.37,27.68 71.12,27.93 71.12,44.31 H7.1

## Copper pours and planes (outline as drawn; the poured copper is in the pictures)
GND on Top Layer: -2.16,82.16 103.5,82.16 103.5,-2.93 -2.16,-2.93
GND on Bottom Layer: -2.92,82.92 106.17,82.92 106.17,-3.31 -2.92,-3.31

Small or netless copper shapes (teardrops, artwork), in the pictures only: 186 on Top Layer, 176 on Bottom Layer

## Text on the board
Top Silkscreen Layer: 12V | GND | 5V | 3.3V | PB11 | PA7 | PA3 | PC10 | PD2 | PB12 | PA6 | PC11 | PA2 | PB10 | PC13 | PB13 | PA8 | PA5 | PB2 | PC14 | PB14 | PA9 | PA4 | PB1 | PC15 | PA10 | PB0 | PB15 | PC9 | PA12 | PA11 | PC0 | PC1 | PC8 | BO2B | BO1B | AO2B | AO1B | PC7 | PC3 | PC2 | PC4 | PC5 | PC6 | BO2A | AO1A | BO1A | AO2A | PC12 | PB8 | PB9 | 5v
